# Altium project 4ADI_2DO.PrjPCB (part 3 of 6)
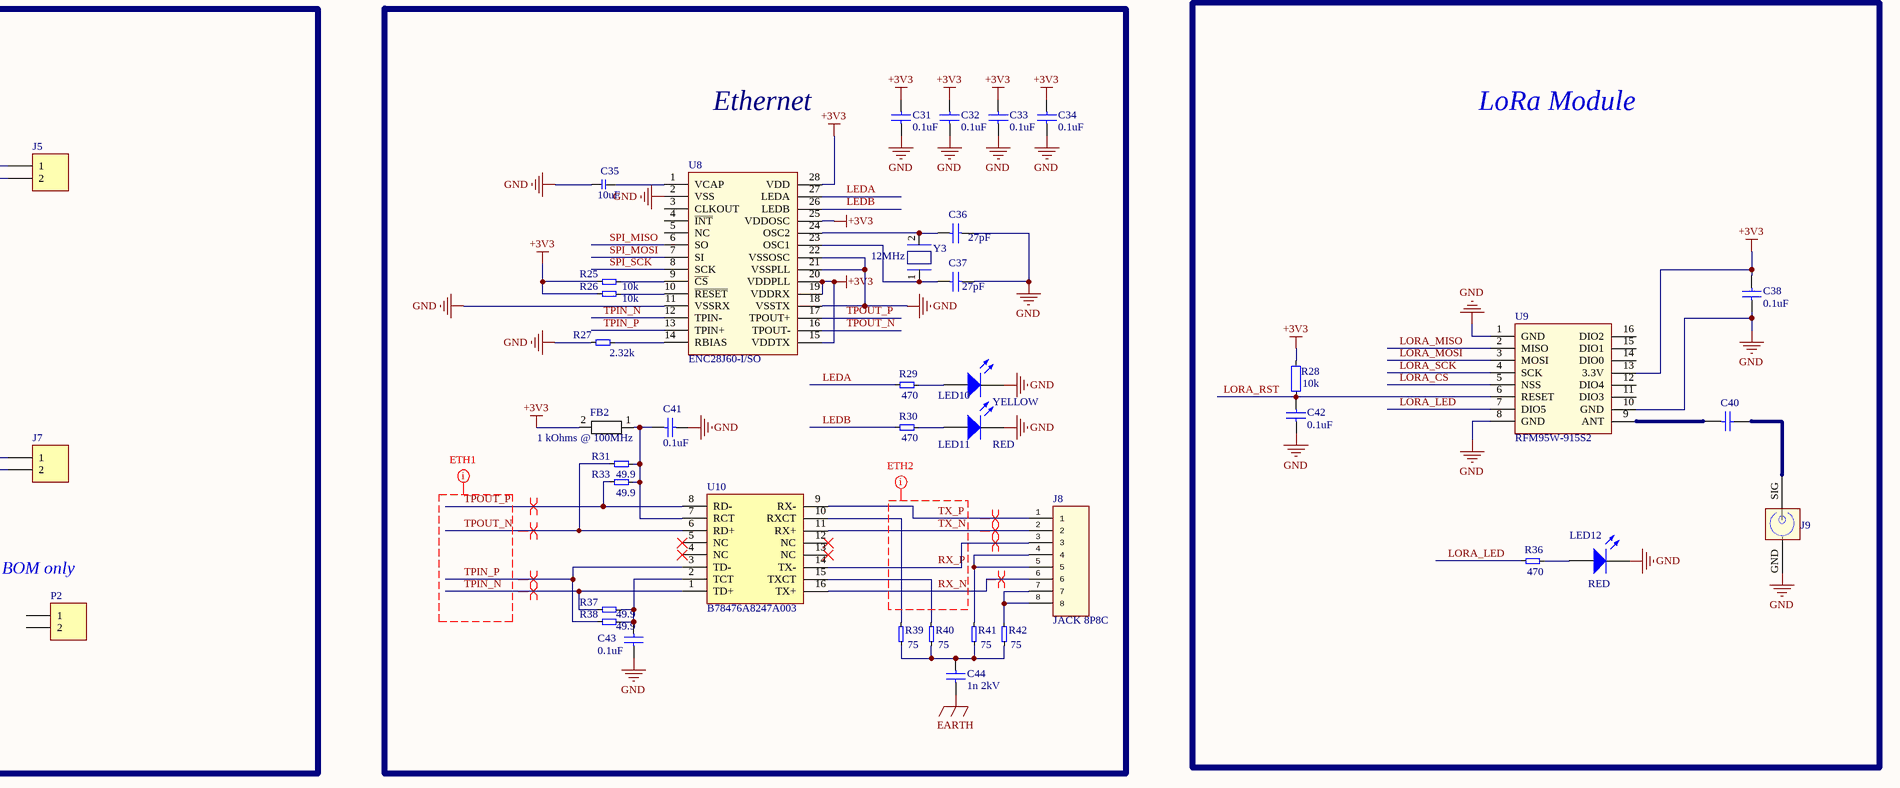
[diagram p9: main board.SchDoc, bottom right]

## Sheet main board.SchDoc (continued)

### Library data of the parts (continued)
U8 = ENC28J60-I_SO: IC ETHERNET CTRLR W/SPI 28SOIC; Manufacturer: Microchip; Interface: SPI; Operating Supply Voltage: 3.3V; Data Rate: 10Mbps; Min Supply Voltage: 3.1V; Max Supply Voltage: 3.6V; Nominal Supply Current: 180mA; Frequency: 20MHz; Supplier 1: Digi-Key; Supplier Part Number 1: ENC28J60-I/SO-ND; Manufacturer Part Number: ENC28J60-I/SO; Stock 1: 937; Pricing 1: 1=2.91, 25=2.678, 100=2.4205 (USD); Mount: Surface Mount; Case/Package: SOIC; Number of Pins: 28; Min Operating Temperature: -40°C; Max Operating Temperature: 85°C; Package Quantity: 27; Packaging: Rail/Tube; Max Supply Current: 180mA; Length: 17.9mm; Height: 2.05mm; Width: 7.5mm; Radiation Hardening: No; REACH SVHC: No SVHC; Lead Free: Lead Free; ComponentLink1URL: http://www.mouser.com/ds/2/268/39662b-62019.pdf?src-supplier=Mouser; ComponentLink1Description: http://www.mouser.com/ds/2/268/39662b-62019.pdf?src-supplier=Mouser; ComponentLink2URL: http://www.microchip.com/mymicrochip/filehandler.aspx?ddocname=en023091&src-supplier=Digi-Key; ComponentLink2Description: http://www.microchip.com/mymicrochip/filehandler.aspx?ddocname=en023091&src-supplier=Digi-Key; ComponentLink3URL: https://www.alliedelec.com/m/d/66624edf4e0ec81faff8e84d1849af36.pdf?src-supplier=Allied+Electronics; ComponentLink3Description: https://www.alliedelec.com/m/d/66624edf4e0ec81faff8e84d1849af36.pdf?src-supplier=Allied+Electronics; ComponentLink4URL: http://ww1.microchip.com/downloads/en/DeviceDoc/39662c.pdf?src-supplier=Avnet+Europe; ComponentLink4Description: http://ww1.microchip.com/downloads/en/DeviceDoc/39662c.pdf?src-supplier=Avnet+Europe; ComponentLink5URL: https://www.distrelec.biz/Web/Downloads/e_/en/bdMicrochip_Ethernet-Interface_EN.pdf?mime=application%2Fpdf&src-supplier=Distrelec; ComponentLink5Description: https://www.distrelec.biz/Web/Downloads/e_/en/bdMicrochip_Ethernet-Interface_EN.pdf?mime=application%2Fpdf&src-supplier=Distrelec; ComponentLink6URL: http://www.farnell.com/datasheets/1700966.pdf?src-supplier=Element14; ComponentLink6Description: http://www.farnell.com/datasheets/1700966.pdf?src-supplier=Element14; ComponentLink7URL: http://ww1.microchip.com/downloads/en/DeviceDoc/39662c.pdf?src-supplier=Avnet; ComponentLink7Description: http://ww1.microchip.com/downloads/en/DeviceDoc/39662c.pdf?src-supplier=Avnet; ComponentLink8URL: http://ww1.microchip.com/downloads/en/DeviceDoc/39662c.pdf?src-supplier=Avnet+Asia; ComponentLink8Description: http://ww1.microchip.com/downloads/en/DeviceDoc/39662c.pdf?src-supplier=Avnet+Asia; ComponentLink9URL: http://www.produktinfo.conrad.com/datenblaetter/650000-674999/651376-da-01-en-IC_ETH__CONTR__ENC28J60_I_SO_SOIC_28_MCP.pdf?src-supplier=Conrad; ComponentLink9Description: http://www.produktinfo.conrad.com/datenblaetter/650000-674999/651376-da-01-en-IC_ETH__CONTR__ENC28J60_I_SO_SOIC_28_MCP.pdf?src-supplier=Conrad
U9 = RFM95W-915S2: Lora Transceiver Module; Manufacturer: Texas Instruments; Manufacturer Part Number: TPS54561DPRR; Switching Frequency: 2.5MHz; Number of Outputs: 1; Output Voltage: 59V; Max Output Current: 5A; Min Input Voltage: 4.5V; Max Input Voltage: 60V; Synchronous Rectifier: No; Min Output Voltage: 800mV; Quiescent Current: 152uA; Output Type: Adjustable; Output Configuration: Positive; Supplier 1: Digi-Key; Supplier Part Number 1: 296-40803-1-ND; Stock 1: 14195; Pricing 1: 1=5.52, 10=4.962, 100=4.0652, 500=3.46064, 1000=2.91861 (USD); Mount: Surface Mount; Number of Pins: 10; Min Operating Temperature: -40°C; Max Operating Temperature: 125°C; Package Quantity: 3000; Packaging: Tape and Reel; Output Current: 5A; Max Output Voltage: 59V; Operating Supply Voltage: 60V; Radiation Hardening: No; Lead Free: Lead Free; ComponentLink1URL: http://www.ti.com/lit/ds/symlink/tps54561.pdf?src-supplier=Digi-Key; ComponentLink1Description: http://www.ti.com/lit/ds/symlink/tps54561.pdf?src-supplier=Digi-Key; ComponentLink2URL: http://www.ti.com/lit/ds/symlink/tps54561.pdf?src-supplier=Avnet; ComponentLink2Description: http://www.ti.com/lit/ds/symlink/tps54561.pdf?src-supplier=Avnet
U10 = B78476A8247A003: PULSE XFMR 1CT:1CT 350UH; Manufacturer: TDK EPCOS; Turns Ratio: 1:1; Insertion Loss: -1dB; Return Loss: -12dB; Lead/Base Style: Gull Wing; Isolation Voltage: 1.5kV; Supplier 1: Digi-Key; Supplier Part Number 1: 495-4025-1-ND; Manufacturer Part Number: B78476A8247A003; Stock 1: 19000; Pricing 1: 1=3.12, 10=2.527, 25=2.0432, 50=1.9142, 100=1.8281, 250=1.77436 (USD); Mount: Surface Mount; Number of Pins: 16; Min Operating Temperature: -40°C; Max Operating Temperature: 85°C; Packaging: Tape and Reel; Inductance: 350uH; Length: 12.7mm; Depth: 9.4mm; REACH SVHC: No SVHC; ComponentLink1URL: http://www.farnell.com/datasheets/2294667.pdf?src-supplier=Element14; ComponentLink1Description: http://www.farnell.com/datasheets/2294667.pdf?src-supplier=Element14; ComponentLink2URL: http://www.farnell.com/datasheets/78237.pdf?src-supplier=Element14; ComponentLink2Description: http://www.farnell.com/datasheets/78237.pdf?src-supplier=Element14; ComponentLink3URL: http://www.farnell.com/datasheets/78237.pdf?src-supplier=Farnell; ComponentLink3Description: http://www.farnell.com/datasheets/78237.pdf?src-supplier=Farnell
Y1 = XTAL: CRYSTAL 12.0000MHZ 18PF T/H; Manufacturer_Name: ABRACON; Manufacturer_Part_Number: ABL-12.000MHZ-B2; Frequency Tolerance: 20ppm; ESR (Equivalent Series Resistance): 50R; Frequency Stability: 50ppm; RS Part Number: *; RS Price/Stock: *; Arrow Part Number: ABL-12.000MHZ-B2; Arrow Price/Stock: https://www.arrow.com/en/products/abl-12.000mhz-b2/abracon; Datasheet Link: https://abracon.com/Resonators/ABL.pdf; Supplier 1: Digi-Key; Supplier Part Number 1: 535-9037-ND; Manufacturer: Abracon; Manufacturer Part Number: ABL-12.000MHZ-B2; Stock 1: 3252; Pricing 1: 1=0.33, 10=0.275, 50=0.2476, 100=0.22, 500=0.209, 1000=0.176, 2500=0.165, 5000=0.1595, 10000=0.154 (USD); Mount: Through Hole; Number of Pins: 2; Min Operating Temperature: -20°C; Max Operating Temperature: 70°C; Load Capacitance: 18pF; Frequency: 12MHz; Package Quantity: 1000; Packaging: Bulk; Tolerance: 20ppm; Termination: Radial; Series Resistance: 50R; Length: 0.453inch; Height: 0.138inch; Width: 0.197inch; Radiation Hardening: No; REACH SVHC: No SVHC; Lead Free: Lead Free; ComponentLink1URL: https://abracon.com/Resonators/ABL.pdf?src-supplier=Digi-Key; ComponentLink1Description: https://abracon.com/Resonators/ABL.pdf?src-supplier=Digi-Key; ComponentLink2URL: http://www.farnell.com/datasheets/1359171.pdf?src-supplier=Element14; ComponentLink2Description: http://www.farnell.com/datasheets/1359171.pdf?src-supplier=Element14
Y2 = Q_GND1: CRYSTAL 32.7680KHZ 12.5PF TH; Manufacturer: CTS; Manufacturer Part Number: TFSM262P32K7680; Supplier 1: Digi-Key; Supplier Part Number 1: CTX1460CT-ND; Stock 1: 5576; Pricing 1: 1=0.52, 10=0.435, 50=0.391, 100=0.3476, 500=0.33022, 1000=0.27808 (USD)
Y3 = XTAL: CRYSTAL 12.0000MHZ 18PF T/H; Manufacturer: Abracon; Manufacturer Part Number: ABL-12.000MHZ-B2; Frequency Tolerance: 20ppm; Frequency Stability: 50ppm; ESR (Equivalent Series Resistance): 50R; ComponentLink1URL: https://abracon.com/Resonators/ABL.pdf?src-supplier=Digi-Key; ComponentLink1Description: https://abracon.com/Resonators/ABL.pdf?src-supplier=Digi-Key; ComponentLink2URL: http://www.farnell.com/datasheets/1359171.pdf?src-supplier=Element14; ComponentLink2Description: http://www.farnell.com/datasheets/1359171.pdf?src-supplier=Element14; Supplier 1: Digi-Key; Supplier Part Number 1: 535-9037-ND; Stock 1: 3252; Pricing 1: 1=0.33, 10=0.275, 50=0.2476, 100=0.22, 500=0.209, 1000=0.176, 2500=0.165, 5000=0.1595, 10000=0.154 (USD); Mount: Through Hole; Number of Pins: 2; Min Operating Temperature: -20°C; Max Operating Temperature: 70°C; Load Capacitance: 18pF; Frequency: 12MHz; Package Quantity: 1000; Packaging: Bulk; Tolerance: 20ppm; Termination: Radial; Series Resistance: 50R; Length: 0.453inch; Height: 0.138inch; Width: 0.197inch; Radiation Hardening: No; Lead Free: Lead Free; REACH SVHC: No SVHC
TP1 = Test point: Supplier 1: Digi-Key